# Altium schematic sheet LCDuino.SchDoc
size A4
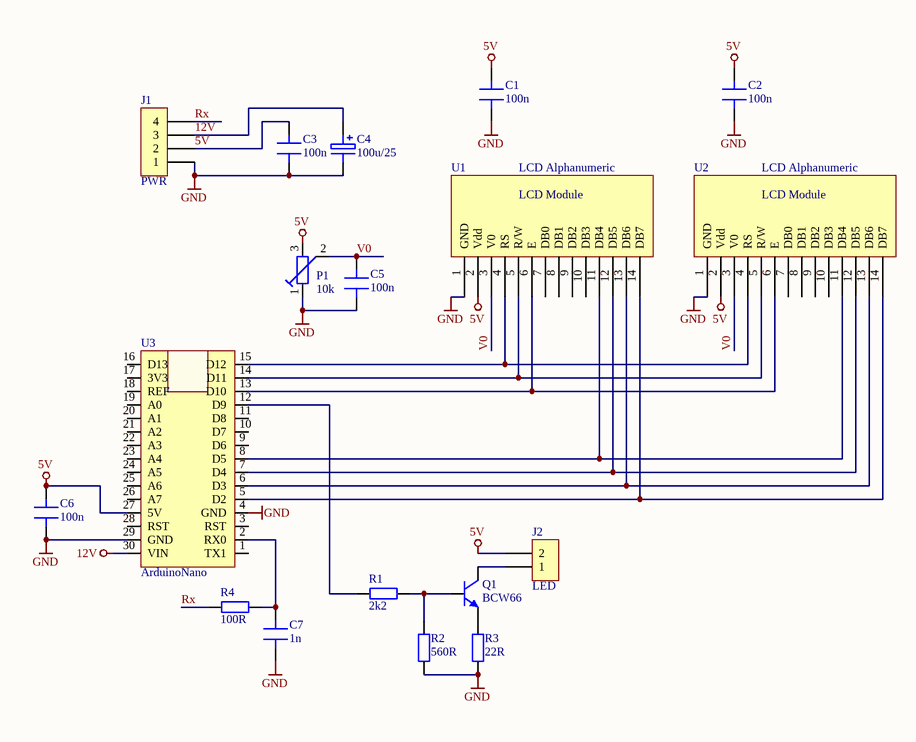
[diagram p0: LCDuino.SchDoc]

## Parts
C1  100n  [0805]
C2  100n  [0805]
C3  100n  [0805]
C4  100u/25  [SMD D]
C5  100n  [0805]
C6  100n  [0805]
C7  1n  [0805]
J1  PWR  [MTS04008]
J2  LED  [2pin100]
P1  10k  [CA6VSMD]
Q1  BCW66  [SOT23]
R1  2k2  [0805]
R2  560R  [0805]
R3  22R  [0805]
R4  100R  [0805]
U1  LCD Alphanumeric  [LCDM14pin]
U2  LCD Alphanumeric  [LCDM_2x7pin]
U3  ArduinoNano  [ArduinoNano]

## Nets
5V: C1.1 C2.1 C3.1 C6.1 J1.2 J2.2 P1.3 U1.2(Vdd) U2.2(Vdd) U3.27(5V)
12V: C4.1 J1.3 U3.30(VIN)
GND: C1.2 C2.2 C3.2 C4.2 C5.2 C6.2 C7.2 J1.1 P1.1 R2.1 R3.1 U1.1(GND) U2.1(GND) U3.4(GND) U3.29(GND)
Rx: J1.4 R4.1
V0: C5.1 P1.2 U1.3(V0) U2.3(V0)
NetC7_1: C7.1 R4.2 U3.2(RX0)
NetJ2_1: J2.1 Q1.3(C)
NetQ1_1: Q1.1(B) R1.2 R2.2
NetQ1_2: Q1.2(E) R3.2
NetR1_1: R1.1 U3.12(D9)
NetU1_4: U1.4(RS) U2.4(RS) U3.15(D12)
NetU1_5: U1.5(R/W) U2.5(R/W) U3.14(D11)
NetU1_6: U1.6(E) U2.6(E) U3.13(D10)
NetU1_11: U1.11(DB4) U2.11(DB4) U3.8(D5)
NetU1_12: U1.12(DB5) U2.12(DB5) U3.7(D4)
NetU1_13: U1.13(DB6) U2.13(DB6) U3.6(D3)
NetU1_14: U1.14(DB7) U2.14(DB7) U3.5(D2)

Not connected (* = marked no-connect by the designer): U1 7(DB0) 8(DB1) 9(DB2) 10(DB3); U2 7(DB0) 8(DB1) 9(DB2) 10(DB3); U3 1(TX1) 3(RST) 9(D6) 10(D7) 11(D8) 16(D13) 17(3V3) 18(REF) 19(A0) 20(A1) 21(A2) 22(A3) 23(A4) 24(A5) 25(A6) 26(A7) 28(RST)

## Notes on the sheet
- (in symbol LCD_Modul) LCD Module

## Library data of the parts
C1-C3 C5-C7 = C: kondenzator
C4 = C_EL: Kondenzator elektroliticky
J1 = CON4: Connector
J2 = CON2: Connector
P1 = TRIMER
Q1 = BCW66: NPN SMD
R1-R4 = R: Rezistor; Version: 1.1
U1 U2 = LCD_Modul: OLED
U3 = ArduinoNano: Arduino Nano V3.0 ATmega328 16M 5V CH340G